# EAGLE design 23XXAdapter_v1.1 (EAGLE 7.7.0)
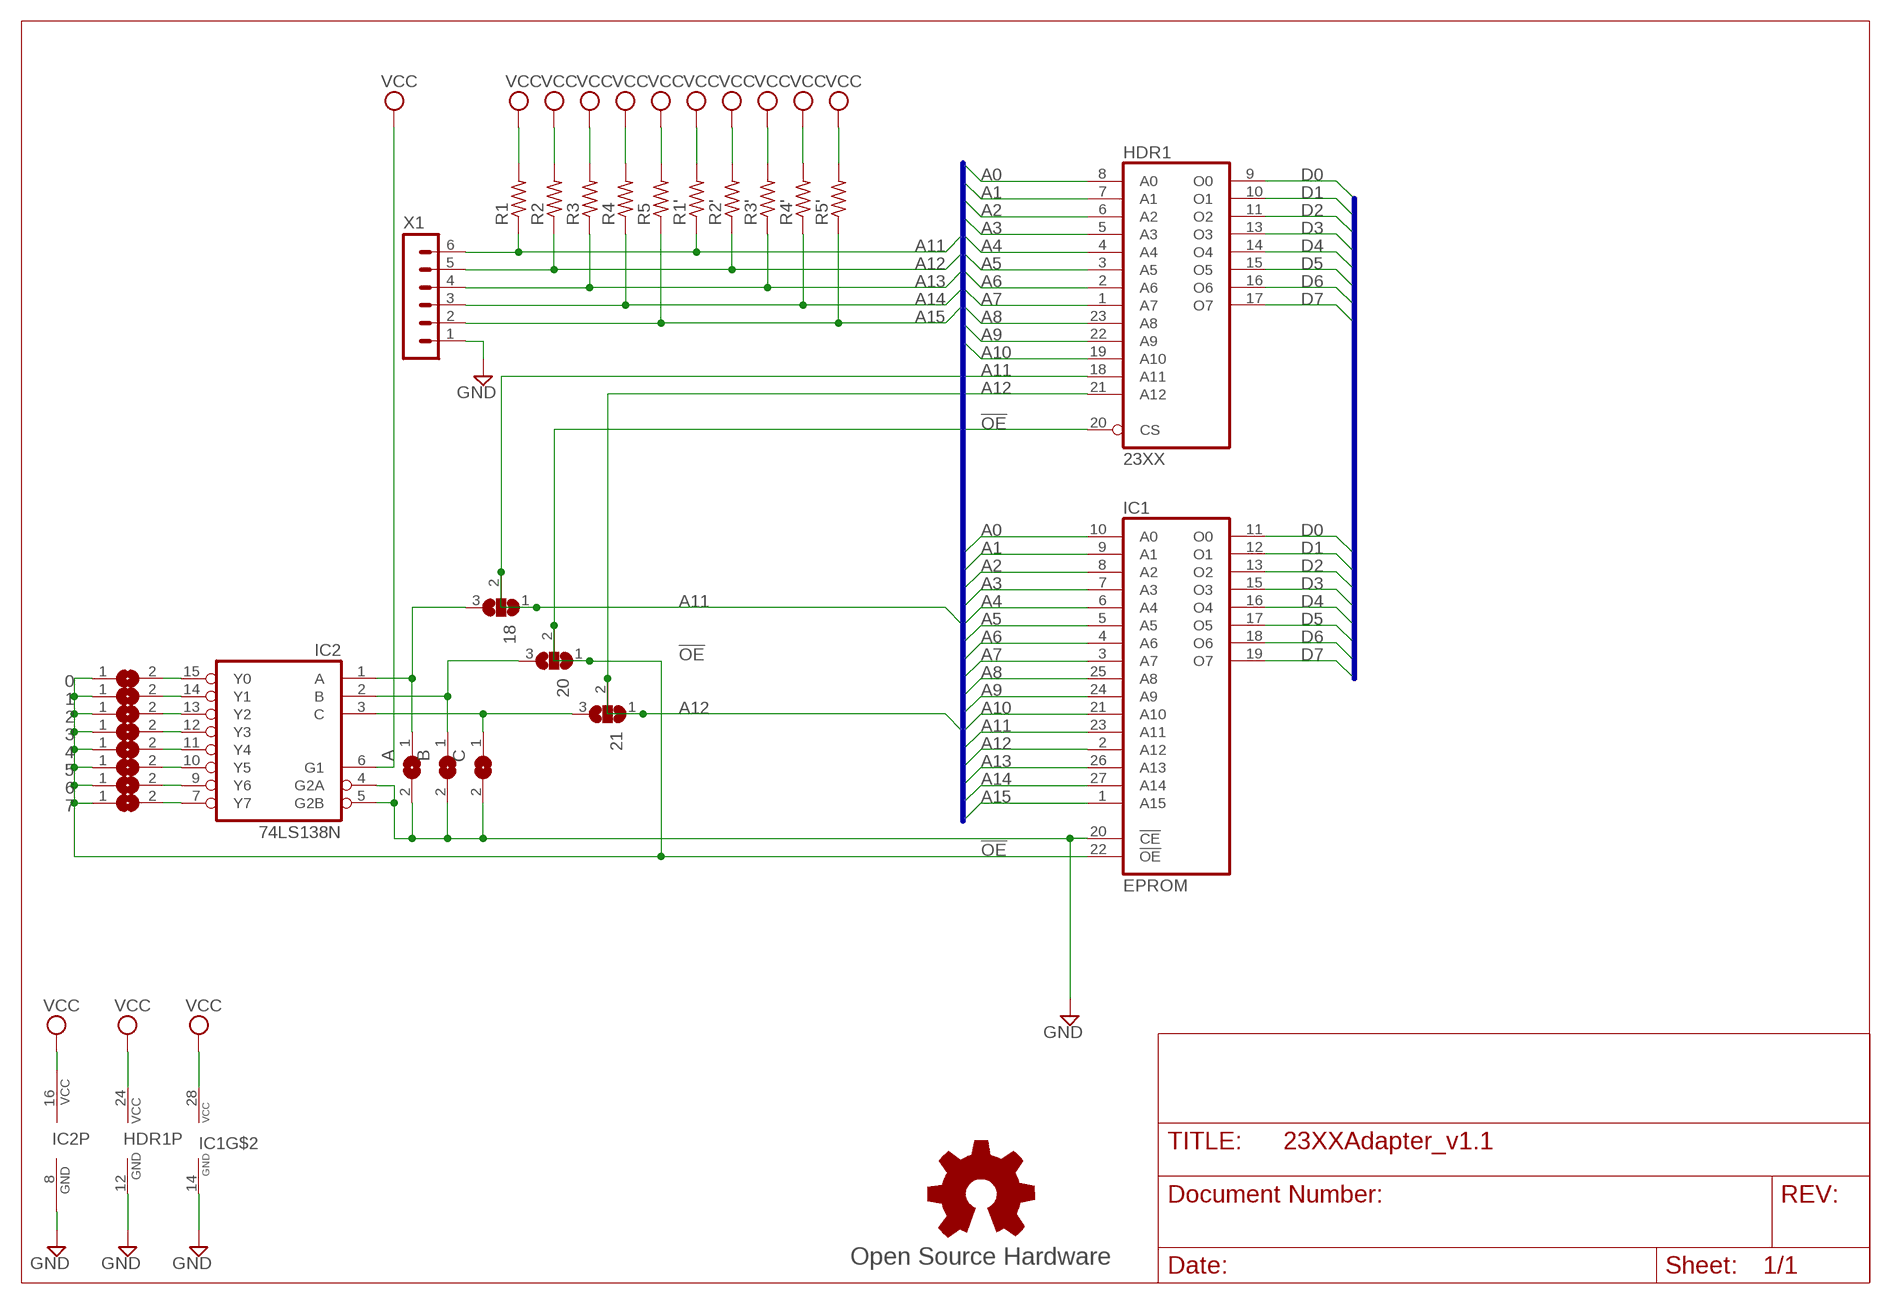
[diagram p0: schematic, sheet 1]

## Parts
0  SJ  [SJ]
1  SJ  [SJ]
2  SJ  [SJ]
3  SJ  [SJ]
4  SJ  [SJ]
5  SJ  [SJ]
6  SJ  [SJ]
7  SJ  [SJ]
18  SJ2W  [SJ_2]
20  SJ2W  [SJ_2]
21  SJ2W  [SJ_2]
A  SJ  [SJ]
B  SJ  [SJ]
C  SJ  [SJ]
GOLD_ORB_SM1  Open Source Hardware  OSHWLOGOLOGO5MM  [OSHW_5MM]
HDR1  23XX  2364'RD'  [DIL24-ROUNDPAD]
IC1  EPROM  27512'RD'  [DIL28-ROUNDPAD]
IC2  74LS138N  [DIL16-RP]
R1  R-US_0204/5  [0204/5]
R1'  R-US_R0805  [R0805]
R2  R-US_0204/5  [0204/5]
R2'  R-US_R0805  [R0805]
R3  R-US_0204/5  [0204/5]
R3'  R-US_R0805  [R0805]
R4  R-US_0204/5  [0204/5]
R4'  R-US_R0805  [R0805]
R5  R-US_0204/5  [0204/5]
R5'  R-US_R0805  [R0805]
X1  MA06-1  [MA06-1]

## Nets
!OE: 0.1 1.1 2.1 3.1 4.1 5.1 6.1 7.1 20.1 20.2 HDR1.20(CS) IC1.22(!OE)
A0: HDR1.8(A0) IC1.10(A0)
A1: HDR1.7(A1) IC1.9(A1)
A2: HDR1.6(A2) IC1.8(A2)
A3: HDR1.5(A3) IC1.7(A3)
A4: HDR1.4(A4) IC1.6(A4)
A5: HDR1.3(A5) IC1.5(A5)
A6: HDR1.2(A6) IC1.4(A6)
A7: HDR1.1(A7) IC1.3(A7)
A8: HDR1.23(A8) IC1.25(A8)
A9: HDR1.22(A9) IC1.24(A9)
A10: HDR1.19(A10) IC1.21(A10)
A11: 18.1 18.2 HDR1.18(A11) IC1.23(A11) R1'.1 R1.1 X1.6
A12: 21.1 21.2 HDR1.21(A12) IC1.2(A12) R2'.1 R2.1 X1.5
A13: IC1.26(A13) R3'.1 R3.1 X1.4
A14: IC1.27(A14) R4'.1 R4.1 X1.3
A15: IC1.1(A15) R5'.1 R5.1 X1.2
D0: HDR1.9(O0) IC1.11(O0)
D1: HDR1.10(O1) IC1.12(O1)
D2: HDR1.11(O2) IC1.13(O2)
D3: HDR1.13(O3) IC1.15(O3)
D4: HDR1.14(O4) IC1.16(O4)
D5: HDR1.15(O5) IC1.17(O5)
D6: HDR1.16(O6) IC1.18(O6)
D7: HDR1.17(O7) IC1.19(O7)
GND: A.2 B.2 C.2 HDR1.12(GND) IC1.14(GND) IC1.20(!CE) IC2.4(G2A) IC2.5(G2B) IC2.8(GND) X1.1
N$1: 20.3 B.1 IC2.2(B)
N$4: 0.2 IC2.15(Y0)
N$6: 1.2 IC2.14(Y1)
N$7: 2.2 IC2.13(Y2)
N$8: 3.2 IC2.12(Y3)
N$9: 4.2 IC2.11(Y4)
N$10: 5.2 IC2.10(Y5)
N$11: 6.2 IC2.9(Y6)
N$12: 7.2 IC2.7(Y7)
N$13: 21.3 C.1 IC2.3(C)
N$16: 18.3 A.1 IC2.1(A)
VCC: HDR1.24(VCC) IC1.28(VCC) IC2.6(G1) IC2.16(VCC) R1'.2 R1.2 R2'.2 R2.2 R3'.2 R3.2 R4'.2 R4.2 R5'.2 R5.2

## Buses
A[0..15]
D[0..7]

## Library data of the parts
0 1-7 A B C = jumper:SJ: SMD solder JUMPER
18 20 21 = jumper:SJ2W: SMD solder JUMPER
GOLD_ORB_SM1 = oshw:OSHWLOGO: The OSHW logo for PCB layout
HDR1 = 0RB_Memory:2364: ROM used by Commodore
IC1 = 0RB_Memory:27512
IC2 = 74xx-us-jlb:74*138: 3-line to 8-line DECODER/DEMULTIPLEXER
R1 R1' R2 R2' R3 R3' R4 R4' R5 R5' = resistor:R-US_: RESISTOR, American symbol
X1 = con-lstb-rp:MA06-1: PIN HEADER; OC_FARNELL: unknown; OC_NEWARK: unknown

## Board
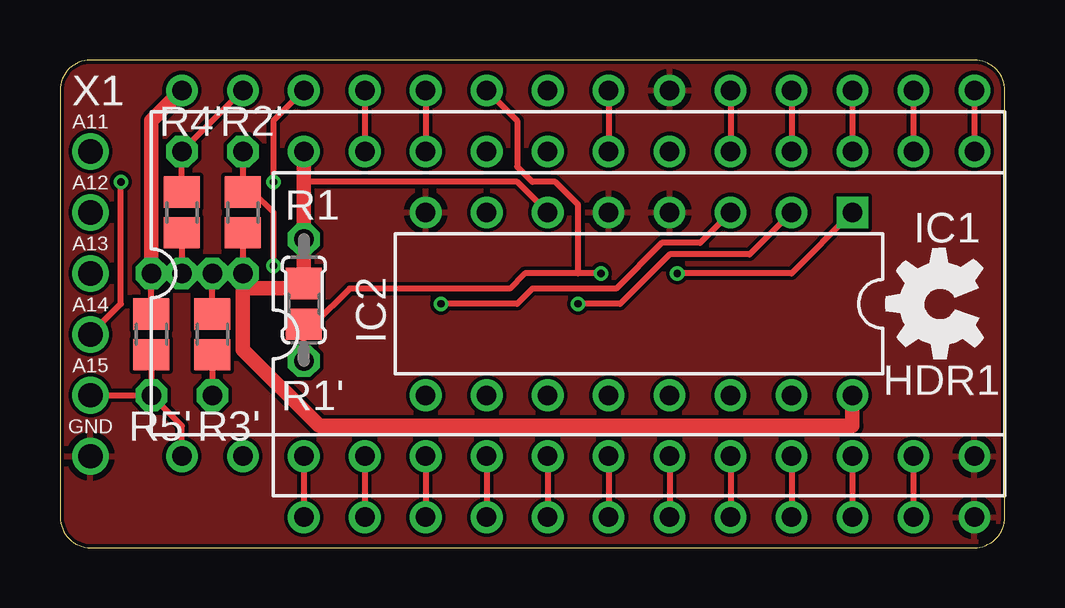
[diagram p1: board, top side]
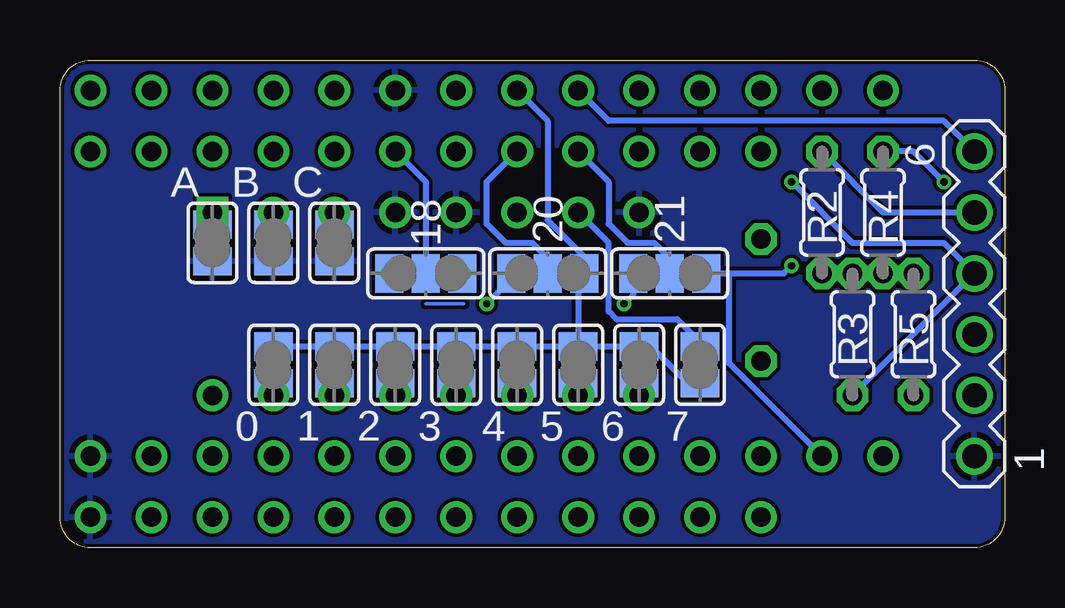
[diagram p2: board, bottom side, seen from below]

Size 39.37 x 20.32 mm. Coordinates in mm from the lower left corner, seen from the top.
Outline: 0,19.05 0.01,1.27 arc90 1.28,0 38.1,0 arc90 39.37,1.27 39.37,19.05 arc90 38.1,20.32 1.27,20.32 arc90 0,19.05
Copper layers (1*16): Top 0.035mm / dielectric 1.5mm / Bottom 0.035mm
Design rules "hackvana *": minimum track width 6mil, minimum drill 0.3mm, track to track 6mil, track to pad 6mil, pad to pad 6mil, via to via 6mil, smd to smd 0mil, copper to edge 6mil, drill to drill 6mil, minimum pad ring 10mil, minimum via ring 6mil, stop-mask expansion 2mil, vias tented up to drill 100mil, thermal gap 10mil

### Footprints (pad centres in the part's own frame; a part is rotated, then mirrored left to right if it is on the bottom)
SJ = smd 1.168 x 1.6: 1 -0.762,0; 2 0.762,0
SJ_2 = smd 1.168 x 1.6: 1 -1.524,0; 2 0,0; 3 1.524,0
DIL24-ROUNDPAD = drill 0.813: 1 -13.97,-7.62; 2 -11.43,-7.62; 3 -8.89,-7.62; 4 -6.35,-7.62; 5 -3.81,-7.62; 6 -1.27,-7.62; 7 1.27,-7.62; 8 3.81,-7.62; 9 6.35,-7.62; 10 8.89,-7.62; 11 11.43,-7.62; 12 13.97,-7.62; 13 13.97,7.62; 14 11.43,7.62; 15 8.89,7.62; 16 6.35,7.62; 17 3.81,7.62; 18 1.27,7.62; 19 -1.27,7.62; 20 -3.81,7.62; 21 -6.35,7.62; 22 -8.89,7.62; 23 -11.43,7.62; 24 -13.97,7.62
DIL28-ROUNDPAD = drill 0.813: 1 -16.51,-7.62; 2 -13.97,-7.62; 3 -11.43,-7.62; 4 -8.89,-7.62; 5 -6.35,-7.62; 6 -3.81,-7.62; 7 -1.27,-7.62; 8 1.27,-7.62; 9 3.81,-7.62; 10 6.35,-7.62; 11 8.89,-7.62; 12 11.43,-7.62; 13 13.97,-7.62; 14 16.51,-7.62; 15 16.51,7.62; 16 13.97,7.62; 17 11.43,7.62; 18 8.89,7.62; 19 6.35,7.62; 20 3.81,7.62; 21 1.27,7.62; 22 -1.27,7.62; 23 -3.81,7.62; 24 -6.35,7.62; 25 -8.89,7.62; 26 -11.43,7.62; 27 -13.97,7.62; 28 -16.51,7.62
DIL16-RP = drill 0.813 square: 1 -8.89,-3.81 | drill 0.813: 2 -6.35,-3.81; 3 -3.81,-3.81; 4 -1.27,-3.81; 5 1.27,-3.81; 6 3.81,-3.81; 7 6.35,-3.81; 8 8.89,-3.81; 9 8.89,3.81; 10 6.35,3.81; 11 3.81,3.81; 12 1.27,3.81; 13 -1.27,3.81; 14 -3.81,3.81; 15 -6.35,3.81; 16 -8.89,3.81
0204/5 = drill 0.813 octagon: 1 -2.54,0; 2 2.54,0
R0805 = smd 1.3 x 1.5: 1 -0.85,0; 2 0.85,0
MA06-1 = drill 1.016: 1 -6.35,0; 2 -3.81,0; 3 -1.27,0; 4 1.27,0; 5 3.81,0; 6 6.35,0

### Placement (x,y rotation side)
0  30.48,7.62 270 bottom
1  27.94,7.62 270 bottom
2  25.4,7.62 270 bottom
3  22.86,7.62 270 bottom
4  20.32,7.62 270 bottom
5  17.78,7.62 270 bottom
6  15.24,7.62 270 bottom
7  12.7,7.62 90 bottom
18  24.13,11.43 180 bottom
20  19.05,11.43 180 bottom
21  13.97,11.43 180 bottom
A  33.02,12.7 270 bottom
B  30.48,12.7 270 bottom
C  27.94,12.7 270 bottom
GOLD_ORB_SM1  36.67,10.16 90 top
HDR1  24.13,8.89 0 top
IC1  21.59,11.43 0 top
IC2  24.13,10.16 180 top
R1  10.16,10.32 90 top
R1'  10.16,10.16 90 top
R2  7.62,13.97 270 bottom
R2'  7.62,13.97 270 top
R3  6.35,8.89 90 bottom
R3'  6.35,8.89 90 top
R4  5.08,13.97 270 bottom
R4'  5.08,13.97 270 top
R5  3.81,8.89 90 bottom
R5'  3.81,8.89 90 top
X1  1.27,10.16 90 bottom

### Tracks (layer width: path | path; a pad name or v marks a point on that pad's centre or on a via)
!OE
  Bottom 0.152: 20.2 20.1
  Bottom 0.254: 0.1 1.1 2.1 3.1 4.1 5.1 | 5.1 6.1 14.73,8.38 13.33,6.99 12.83,6.99 7.1 | 5.1 17.78,11.18 20.1 17.53,12.13 19.05,13.65 19.05,17.78 IC1.22 | HDR1.20 21.59,15.24 21.59,13.49 20.8,12.7 19.68,12.7 19.05,12.06 20.2
A0
  Top 0.254: IC1.10 HDR1.8
A1
  Top 0.254: IC1.9 HDR1.7
A2
  Top 0.254: IC1.8 HDR1.6
A3
  Top 0.254: IC1.7 HDR1.5
A4
  Top 0.254: IC1.6 HDR1.4
A5
  Top 0.254: IC1.5 HDR1.3
A6
  Top 0.254: IC1.4 HDR1.2
A7
  Top 0.254: IC1.3 HDR1.1
A8
  Top 0.254: IC1.25 HDR1.23
A9
  Top 0.254: IC1.24 HDR1.22
A10
  Top 0.254: IC1.21 HDR1.19
A11  (via drill 0.3)
  Top 0.254: 21.59,11.43 21.59,14.29 20.64,15.24 19.68,15.24 19.05,15.88 19.05,17.78 IC1.23 | v22.54,11.43 21.59,11.43 | 21.59,11.43 19.37,11.43 18.73,10.79 12.06,10.79 10.58,9.31 R1'.1 R1.1
  Bottom 0.152: 18.2 18.1
  Bottom 0.254: 22.86,11.43 18.1 | 22.86,11.43 | 22.86,11.43 v22.54,11.43 | HDR1.18 24.13,15.24 18.2 | X1.6 2.54,17.78 16.51,17.78 IC1.23
A12  (via drill 0.3)
  Top 0.254: R2.1 R2'.1 8.04,14.82 8.89,13.97 v8.89,11.75
  Bottom 0.152: 21.1 21.2
  Bottom 0.254: R2.1 5.08,13.97 X1.5 | IC1.2 11.49,7.68 11.49,11.43 | 21.1 11.49,11.43 | 11.49,11.43 9.21,11.43 v8.89,11.75 | HDR1.21 16.51,15.24 16.51,13.49 15.72,12.7 14.6,12.7 13.97,12.06 21.2
A13  (via drill 0.3)
  Top 0.254: IC1.26 8.89,17.78 v8.89,15.24 | R3'.1 R3.1
  Bottom 0.254: v8.89,15.24 6.35,12.7 2.54,12.7 X1.4 R3.1
A14  (via drill 0.3)
  Top 0.254: IC1.27 R4.1 R4'.1 | X1.3 2.54,10.16 v2.54,15.24
  Bottom 0.254: v2.54,15.24 3.81,16.51 R4.1
A15
  Top 0.254: X1.2 R5.1 | IC1.1 5.08,5.08 R5.1 | R5'.1 R5.1
D0
  Top 0.254: IC1.11 HDR1.9
D1
  Top 0.254: IC1.12 HDR1.10
D2
  Top 0.254: IC1.13 HDR1.11
D3
  Top 0.254: IC1.15 HDR1.13
D4
  Top 0.254: IC1.16 HDR1.14
D5
  Top 0.254: IC1.17 HDR1.15
D6
  Top 0.254: IC1.18 HDR1.16
D7
  Top 0.254: IC1.19 HDR1.17
GND
  pour Top: 38.1,0 1.27,0 arc-90 0,1.27 0,19.05 arc-90 1.27,20.32 38.1,20.32 arc-90 39.37,19.05 39.37,1.27 arc-90
  pour Bottom: 38.1,0 1.27,0 arc-90 0,1.27 0,19.05 arc-90 1.27,20.32 38.1,20.32 arc-90 39.37,19.05 39.37,1.27 arc-90
N$1  (via drill 0.3)
  Top 0.254: IC2.2 28.73,12.22 25.4,12.22 23.34,10.16 v21.59,10.16
  Bottom 0.254: 20.3 20.57,11.18 v21.59,10.16 | B.1 IC2.2
N$4
  Bottom 0.254: IC2.15 0.2
N$5
  Bottom 0.152: 22.54,10.16 24.13,10.16
N$6
  Bottom 0.254: IC2.14 1.2
N$7
  Bottom 0.254: IC2.13 2.2
N$8
  Bottom 0.254: IC2.12 3.2
N$9
  Bottom 0.254: IC2.11 4.2
N$10
  Bottom 0.254: IC2.10 5.2
N$11
  Bottom 0.254: IC2.9 6.2
N$12
  Bottom 0.254: IC2.7 16.51,12.7 16.51,9.84 16.19,9.53 13.65,9.53 13.02,8.89 13.02,8.7 7.2
N$13  (via drill 0.3)
  Top 0.254: v15.87,10.16 19.05,10.16 19.68,10.79 23.18,10.79 25.08,12.7 26.67,12.7 IC2.3
  Bottom 0.254: 21.3 15.49,10.54 v15.87,10.16 | IC2.3 C.1
N$16  (via drill 0.3)
  Top 0.254: IC2.1 30.48,11.43 v25.72,11.43
  Bottom 0.254: v25.72,11.43 18.3 | A.1 IC2.1
VCC
  Top 0.254: IC2.6 19.05,15.24 10.16,15.24 | R3'.2 R3.2 | R5'.2 R5.2 | R4'.2 R4.2 | R2'.2 R2.2
  Top 0.406: 10.16,14.76 10.16,13.18
  Top 0.61: HDR1.24 10.16,15.24 10.16,13.18 R1.2 R1'.2 9.96,10.81 7.62,10.81 | 7.62,10.81 7.62,8.26 10.79,5.08 33.02,5.08 IC2.16 | 7.62,10.81 R2.2 R3.2 R4.2 R5.2 3.81,17.78 IC1.28

### Text on the board
tNames: A11 | A12 | A13 | A14 | A15 | GND
tValues: (c) 2012-24 | go4retro.com
bTest: 1 | 2 | 3 | 1 | 2 | 3 | 1 | 2 | 3